# Altium project GPS_Tracker.PrjPcb (part 2 of 2)

## Sheet GSM_EC200U.SchDoc
size A3; SheetNumber: 3; SheetTotal: 3
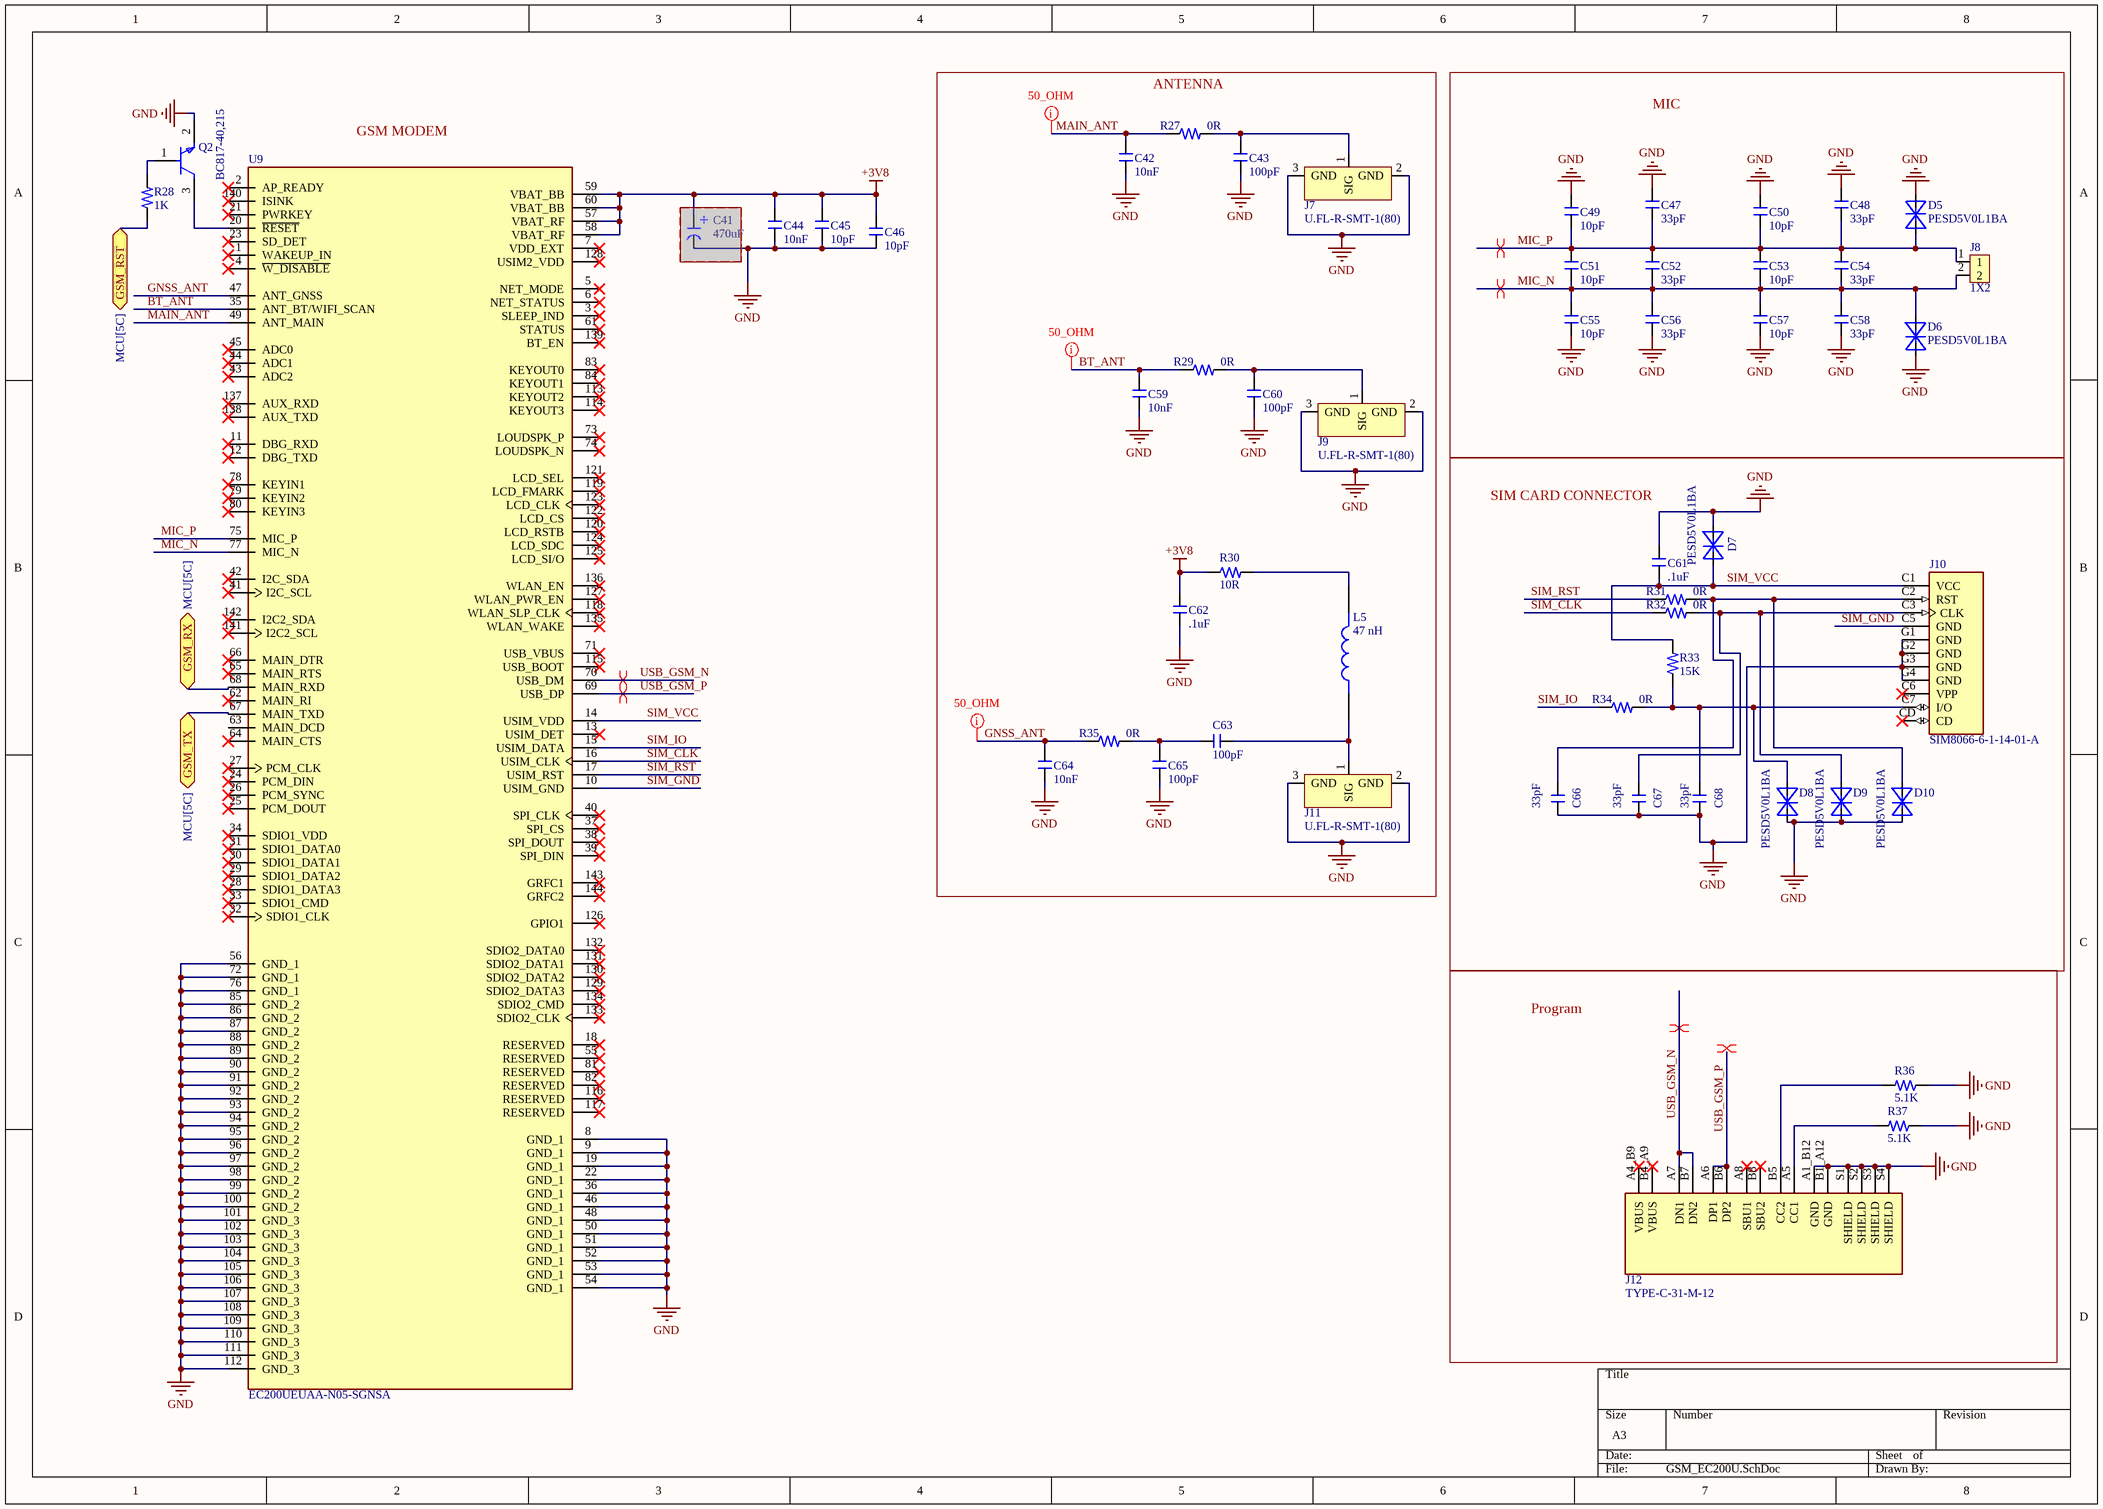
[diagram p2: GSM_EC200U.SchDoc]

### Parts
C41  470uF  [CAP SMD,D8xL10.2mm]  (masked out: inside a compile mask, not in the netlist)
C42  10nF  [Capacitor_0805]
C43  100pF  [Capacitor_0805]
C44  10nF  [Capacitor_0805]
C45  10pF  [Capacitor_0805]
C46  10pF  [Capacitor_0805]
C47  33pF  [Capacitor_0805]
C48  33pF  [Capacitor_0805]
C49  10pF  [Capacitor_0805]
C50  10pF  [Capacitor_0805]
C51  10pF  [Capacitor_0805]
C52  33pF  [Capacitor_0805]
C53  10pF  [Capacitor_0805]
C54  33pF  [Capacitor_0805]
C55  10pF  [Capacitor_0805]
C56  33pF  [Capacitor_0805]
C57  10pF  [Capacitor_0805]
C58  33pF  [Capacitor_0805]
C59  10nF  [Capacitor_0805]
C60  100pF  [Capacitor_0805]
C61  .1uF  [FB_0805]
C62  .1uF  [FB_0805]
C63  100pF  [Capacitor_0805]
C64  10nF  [Capacitor_0805]
C65  100pF  [Capacitor_0805]
C66  33pF  [Capacitor_0805]
C67  33pF  [Capacitor_0805]
C68  33pF  [Capacitor_0805]
D5  PESD5V0L1BA  [SOT323]
D6  PESD5V0L1BA  [SOT323]
D7  PESD5V0L1BA  [SOT323]
D8  PESD5V0L1BA  [SOT323]
D9  PESD5V0L1BA  [SOT323]
D10  PESD5V0L1BA  [SOT323]
J7  U.FL-R-SMT-1(80)  [UFL]
J8  1X2  [Header 1x2 2.54mm]
J9  U.FL-R-SMT-1(80)  [UFL]
J10  SIM8066-6-1-14-01-A  [SIM]
J11  U.FL-R-SMT-1(80)  [UFL]
J12  TYPE-C-31-M-12  [TYPE-C-31-M-12]
L5  47 nH  [Resistor_0603]
Q2  BC817-40,215  [FP-SOT23-MFG]
R27  0R  [Resistor_0805]
R28  1K  [Resistor_0805]
R29  0R  [Resistor_0805]
R30  10R  [Resistor_0603]
R31  0R  [Resistor_0805]
R32  0R  [Resistor_0805]
R33  15K  [Resistor_0805]
R34  0R  [Resistor_0805]
R35  0R  [Resistor_0805]
R36  5.1K  [Resistor_0805]
R37  5.1K  [Resistor_0805]
U9  EC200UEUAA-N05-SGNSA  [EC200UEUAA-N05-SGNSA]

### Blocks framed on the sheet
ANTENNA: C42 C43 C59 C60 C62-C65 J7 J9 J11 L5 R27 R29 R30 R35
MIC: C47-C58 D5 D6 J8
SIM CARD CONNECTOR: C61 C66-C68 D7-D10 J10 R31-R34
Program: J12 R36 R37

### Ports
GSM_RST (bidir, see MCU[5C]), GSM_RX (bidir, see MCU[5C]), GSM_TX (bidir, see MCU[5C])

### Nets
+3V8: C44.2 C45.2 C46.2 C62.2 R30.1 U9.57(VBAT_RF) U9.58(VBAT_RF) U9.59(VBAT_BB) U9.60(VBAT_BB)
GND: C42.1 C43.2 C44.1 C45.1 C46.1 C47.2 C48.2 C49.2 C50.2 C55.1 C56.1 C57.1 C58.1 C59.1 C60.2 C61.2 C62.1 C64.1 C65.2 C66.1 C67.1 C68.1 D5.C D6.C D7.A D8.C D9.C D10.C J7.2(GND) J7.3(GND) J9.2(GND) J9.3(GND) J10.G1(GND) J10.G2(GND) J10.G3(GND) J10.G4(GND) J11.2(GND) J11.3(GND) J12.A1_B12(GND) J12.B1_A12(GND) J12.S1(SHIELD) J12.S2(SHIELD) J12.S3(SHIELD) J12.S4(SHIELD) Q2.2(E) R36.1 R37.1 U9.8(GND_1) U9.9(GND_1) U9.19(GND_1) U9.22(GND_1) U9.36(GND_1) U9.46(GND_1) U9.48(GND_1) U9.50(GND_1) U9.51(GND_1) U9.52(GND_1) U9.53(GND_1) U9.54(GND_1) U9.56(GND_1) U9.72(GND_1) U9.76(GND_1) U9.85(GND_2) U9.86(GND_2) U9.87(GND_2) U9.88(GND_2) U9.89(GND_2) U9.90(GND_2) U9.91(GND_2) U9.92(GND_2) U9.93(GND_2) U9.94(GND_2) U9.95(GND_2) U9.96(GND_2) U9.97(GND_2) U9.98(GND_2) U9.99(GND_2) U9.100(GND_2) U9.101(GND_3) U9.102(GND_3) U9.103(GND_3) U9.104(GND_3) U9.105(GND_3) U9.106(GND_3) U9.107(GND_3) U9.108(GND_3) U9.109(GND_3) U9.110(GND_3) U9.111(GND_3) U9.112(GND_3)
BT_ANT: C59.2 R29.1 U9.35(ANT_BT/WIFI_SCAN)
GNSS_ANT: C64.2 R35.1 U9.47(ANT_GNSS)
MAIN_ANT: C42.2 R27.1 U9.49(ANT_MAIN)
MIC_N: C51.1 C52.1 C53.1 C54.1 C55.2 C56.2 C57.2 C58.2 D6.A J8.2 U9.77(MIC_N)
MIC_P: C47.1 C48.1 C49.1 C50.1 C51.2 C52.2 C53.2 C54.2 D5.A J8.1 U9.75(MIC_P)
SIM_CLK: R32.1 U9.16(USIM_CLK)
SIM_GND: J10.C5(GND) U9.10(USIM_GND)
SIM_IO: R34.1 U9.15(USIM_DATA)
SIM_RST: R31.1 U9.17(USIM_RST)
SIM_VCC: C61.1 D7.C J10.C1(VCC) R33.2 U9.14(USIM_VDD)
USB_GSM_N: J12.A7(DN1) J12.B7(DN2) U9.70(USB_DM)
USB_GSM_P: J12.A6(DP1) J12.B6(DP2) U9.69(USB_DP)
NetC43_1: C43.1 J7.1(SIG) R27.2
NetC60_1: C60.1 J9.1(SIG) R29.2
NetC63_1: C63.1 C65.1 R35.2
NetC63_2: C63.2 J11.1(SIG) L5.1
NetC66_2: C66.2 D10.A J10.C2(RST) R31.2
NetC67_2: C67.2 D9.A J10.C3(CLK) R32.2
NetC68_2: C68.2 D8.A J10.C7(I/O) R33.1 R34.2
NetJ12_A5: J12.A5(CC1) R37.2
NetJ12_B5: J12.B5(CC2) R36.2
NetL5_2: L5.2 R30.2
NetQ2_1: Q2.1(B) R28.2
NetQ2_3: Q2.3(C) U9.20(~{RESET})
NetR28_1: R28.1 ; port GSM_RST
NetU8_26: U9.68(MAIN_RXD) ; port GSM_RX
NetU8_27: U9.67(MAIN_TXD) ; port GSM_TX

Not connected (* = marked no-connect by the designer): J10 C6(VPP)* CD*; J12 A4_B9(VBUS)* A8(SBU1)* B4_A9(VBUS)* B8(SBU2)*; U9 1(WAKEUP_IN)* 2(AP_READY)* 3(SLEEP_IND)* 4(~{W_DISABLE})* 5(NET_MODE)* 6(NET_STATUS)* 7(VDD_EXT)* 11(DBG_RXD)* 12(DBG_TXD)* 13(USIM_DET)* 18(RESERVED)* 21(PWRKEY)* 23(SD_DET)* 24(PCM_DIN)* 25(PCM_DOUT)* 26(PCM_SYNC)* 27(PCM_CLK)* 28(SDIO1_DATA3)* 29(SDIO1_DATA2)* 30(SDIO1_DATA1)* 31(SDIO1_DATA0)* 32(SDIO1_CLK)* 33(SDIO1_CMD)* 34(SDIO1_VDD)* 37(SPI_CS)* 38(SPI_DOUT)* 39(SPI_DIN)* 40(SPI_CLK)* 41(I2C_SCL)* 42(I2C_SDA)* 43(ADC2)* 44(ADC1)* 45(ADC0)* 55(RESERVED)* 61(STATUS)* 62(MAIN_RI)* 63(MAIN_DCD) 64(MAIN_CTS)* 65(MAIN_RTS)* 66(MAIN_DTR)* 71(USB_VBUS)* 73(LOUDSPK_P)* 74(LOUDSPK_N)* 78(KEYIN1)* 79(KEYIN2)* 80(KEYIN3)* 81(RESERVED)* 82(RESERVED)* 83(KEYOUT0)* 84(KEYOUT1)* 113(KEYOUT2)* 114(KEYOUT3)* 115(USB_BOOT)* 116(RESERVED)* 117(RESERVED)* 118(WLAN_SLP_CLK)* 119(LCD_FMARK)* 120(LCD_RSTB)* 121(LCD_SEL)* 122(LCD_CS)* 123(LCD_CLK)* 124(LCD_SDC)* 125(LCD_SI/O)* 126(GPIO1)* 127(WLAN_PWR_EN)* 128(USIM2_VDD)* 129(SDIO2_DATA3)* 130(SDIO2_DATA2)* 131(SDIO2_DATA1)* 132(SDIO2_DATA0)* 133(SDIO2_CLK)* 134(SDIO2_CMD)* 135(WLAN_WAKE)* 136(WLAN_EN)* 137(AUX_RXD)* 138(AUX_TXD)* 139(BT_EN)* 140(ISINK)* 141(I2C2_SCL)* 142(I2C2_SDA)* 143(GRFC1)* 144(GRFC2)*

### Layout directives
differential pair: MIC_N, MIC_P
differential pair; net class 90_OHM: USB_GSM_N, USB_GSM_P
net class 50_OHM: BT_ANT, GNSS_ANT, MAIN_ANT

### Notes on the sheet
- (near U9) GSM MODEM
- (in symbol CAP 470uF) +

### Library data of the parts
C41 = CAP 470uF: Aluminum Electrolytic Capacitor, 470 uF, 16 V, ± 20%, 2000 hours @ 105°C, Radial Can - SMD; Manufacturer: Panasonic; Manufacturer Part Number: EEE-HBC471UAP; Voltage Rating: 16V; Ripple Current: 240mA; Leakage Current: 3uA; Dissipation Factor: 0.4%; Supplier: Mouser; Supplier Part Number: 667-EEE-HBC471UAP; RoHS: Yes; Category: Aluminum Electrolytic Capacitors; Stock: 104; Pricing: 1=1,02, 10=0,557, 50=0,557, 100=0,472, 1000=0,349, 10000=0,315 (USD); Mounting Technology: Surface Mount; Case/Package: Radial; Min Operating Temperature: -40°C; Max Operating Temperature: 105°C; Value: 470uF; Tolerance: 20%; Packaging: Tape and Reel; Package Quantity: 500; Voltage Rating (DC): 16V; Life (Hours): 2000Hour; Termination: SMD/SMT; Voltage: 16V; Series: HB; Construction: Cylindrical; Diameter: 8mm; Length: 10.2mm; Height: 10.2mm; Ratings: AEC-Q200; Radiation Hardening: No; RoHS Compliant: Yes; ComponentLink1URL: https://datasheet.ciiva.com/11780/0900766b80bed47d-11780359.pdf?src-supplier=Rs; ComponentLink1Description: https://datasheet.ciiva.com/11780/0900766b80bed47d-11780359.pdf?src-supplier=Rs; ComponentLink2URL: https://datasheet.ciiva.com/2985/aba0000ce117-2985891.pdf?src-supplier=Avnet; ComponentLink2Description: https://datasheet.ciiva.com/2985/aba0000ce117-2985891.pdf?src-supplier=Avnet; ComponentLink3URL: https://datasheet.ciiva.com/2985/aba0000ce117-2985890.pdf?src-supplier=Avnet; ComponentLink3Description: https://datasheet.ciiva.com/2985/aba0000ce117-2985890.pdf?src-supplier=Avnet; ComponentLink4URL: https://datasheet.ciiva.com/30093/aba0000ce117-30093671.pdf?src-supplier=Onlinecomponents.com; ComponentLink4Description: https://datasheet.ciiva.com/30093/aba0000ce117-30093671.pdf?src-supplier=Onlinecomponents.com
C42 C44 C59 C64 = Cap_10nF 0805: Multilayer Ceramic Capacitor, 0.01 uF, 50 V, ï¿½ 10%, X7R, 0805 [2012 Metric]; Manufacturer: Samsung; Manufacturer Part Number: CL21B103KBANNNC; Voltage: 50V; Supplier: Digikey; Supplier Part Number: 1276-1015-1-ND; RoHS: Yes; Category: Ceramic Capacitors; Stock: 2729; Pricing: 1=0,08, 10=0,011, 100=0,0096, 1000=0,0072 (USD); Mounting Technology: Surface Mount; Case/Package: 0805; Pins: 2; Case Code (Metric): 2012; Case Code (Imperial): 0805; Material: Ceramic; Min Operating Temperature: -55°C; Max Operating Temperature: 125°C; Value: 10nF; Tolerance: 10%; Dielectric: X7R; Voltage Rating (DC): 50V; Packaging: Tape and Reel; Voltage Rating: 50V; Series: CL; Construction: Flat; Length: 2mm; Height: 0.65mm; Depth: 1.25mm; Radiation Hardening: No; Lead Free: Lead Free; RoHS Compliant: Yes; ComponentLink1URL: https://datasheet.ciiva.com/25709/cl21b103kbannnc-25709781.pdf?src-supplier=Digikey; ComponentLink1Description: https://datasheet.ciiva.com/25709/cl21b103kbannnc-25709781.pdf?src-supplier=Digikey; ComponentLink2URL: https://datasheet.ciiva.com/29199/455082-da-01-en-vs-kondensator-0805-29199459.pdf?src-supplier=Conrad; ComponentLink2Description: https://datasheet.ciiva.com/29199/455082-da-01-en-vs-kondensator-0805-29199459.pdf?src-supplier=Conrad
C43 C60 C63 C65 = CAP 100pF 0805: 0805 100 pF 50 V ±5 % Tolerance NP0 SMT Multilayer Ceramic Capacitor; Manufacturer: Yageo; Manufacturer Part Number: CC0805JRNPO9BN101; Material: 4241ConductorMaterial; Tolerance: 5%; Dielectric: C0G; Voltage Rating: 50V; Temperature Coefficient: 30ppm/°C; Insulation Resistance: 100GR; Supplier: Arrow Electronics; Supplier Part Number: CC0805JRNPO9BN101; RoHS: Yes; Category: Ceramic Capacitors; Stock: 6144000; Pricing: 4000=0,0128, 8000=0,0088, 12000=0,0087, 28000=0,0086, 40000=0,0073, 100000=0,0072, 200000=0,005 (USD); Mounting Technology: Surface Mount; Case/Package: 0805; Pins: 2; Case Code (Imperial): 0805; Case Code (Metric): 2012; Dielectric Material: Ceramic; Min Operating Temperature: -55°C; Max Operating Temperature: 125°C; Value: 100pF; Packaging: Tape and Reel; Package Quantity: 4000; Voltage Rating (DC): 50V; Termination: SMD/SMT; Series: CC; Voltage Rating (AC): 50V; Length: 2mm; Width: 1.25mm; Height: 0.6mm; Depth: 1.25mm; Radiation Hardening: No; RoHS Compliant: Yes; Reach SVHC Compliant: No; Lead Free: Lead Free; Halogen Free: 5694HalogenFree; ComponentLink1URL: https://datasheet.ciiva.com/5425/upy-gp-np0-16v-to-50v-8-217813-5425504.pdf?src-supplier=Mouser; ComponentLink1Description: https://datasheet.ciiva.com/5425/upy-gp-np0-16v-to-50v-8-217813-5425504.pdf?src-supplier=Mouser; ComponentLink2URL: https://datasheet.ciiva.com/144/mlccorderingcode-144855.pdf?src-supplier=Digikey; ComponentLink2Description: https://datasheet.ciiva.com/144/mlccorderingcode-144855.pdf?src-supplier=Digikey; ComponentLink3URL: https://datasheet.ciiva.com/144/mlccorderingcode-144854.pdf?src-supplier=Digikey; ComponentLink3Description: https://datasheet.ciiva.com/144/mlccorderingcode-144854.pdf?src-supplier=Digikey; ComponentLink4URL: https://datasheet.ciiva.com/144/mlccorderingcode-144856.pdf?src-supplier=Digikey; ComponentLink4Description: https://datasheet.ciiva.com/144/mlccorderingcode-144856.pdf?src-supplier=Digikey; ComponentLink5URL: https://datasheet.ciiva.com/8033/1443161-8033950.pdf?src-supplier=Element14; ComponentLink5Description: https://datasheet.ciiva.com/8033/1443161-8033950.pdf?src-supplier=Element14; ComponentLink6URL: https://datasheet.ciiva.com/11464/upy-gp-np0-16v-to-50v-8-11464745.pdf?src-supplier=Avnet; ComponentLink6Description: https://datasheet.ciiva.com/11464/upy-gp-np0-16v-to-50v-8-11464745.pdf?src-supplier=Avnet; ComponentLink7URL: https://datasheet.ciiva.com/8033/1443161-8033947.pdf?src-supplier=Element14; ComponentLink7Description: https://datasheet.ciiva.com/8033/1443161-8033947.pdf?src-supplier=Element14; ComponentLink8URL: https://datasheet.ciiva.com/26829/getdatasheetpartid-92514-26829509.pdf?src-supplier=Verical; ComponentLink8Description: https://datasheet.ciiva.com/26829/getdatasheetpartid-92514-26829509.pdf?src-supplier=Verical
C45 C46 C49-C51 C53 C55 C57 = CAP 10pF 0805: Multilayer Ceramic Capacitor, 10 pF, 50 V, ï¿½ 5%, C0G (NP0), 0805 [2012 Metric]; Manufacturer: Yageo; Manufacturer Part Number: CC0805JRNPO9BN100; Temperature Coefficient: 30ppm/°C; Supplier: Digikey; Supplier Part Number: 311-1099-1-ND; RoHS: Yes; Category: Ceramic Capacitors; Stock: 29904; Pricing: 1=0,1, 10=0,048, 100=0,0284, 1000=0,01828 (USD); Pins: 2NUMBER; Halogen Free: 5694HalogenFree; Lead Free: 5697LeadFree; ComponentLink1URL: https://datasheet.ciiva.com/144/mlccorderingcode-144670.pdf?src-supplier=Digikey; ComponentLink1Description: https://datasheet.ciiva.com/144/mlccorderingcode-144670.pdf?src-supplier=Digikey; ComponentLink2URL: https://datasheet.ciiva.com/144/mlccorderingcode-144671.pdf?src-supplier=Digikey; ComponentLink2Description: https://datasheet.ciiva.com/144/mlccorderingcode-144671.pdf?src-supplier=Digikey; ComponentLink3URL: https://datasheet.ciiva.com/144/mlccorderingcode-144672.pdf?src-supplier=Digikey; ComponentLink3Description: https://datasheet.ciiva.com/144/mlccorderingcode-144672.pdf?src-supplier=Digikey; ComponentLink4URL: https://datasheet.ciiva.com/11464/upy-gp-np0-16v-to-50v-8-11464744.pdf?src-supplier=Avnet; ComponentLink4Description: https://datasheet.ciiva.com/11464/upy-gp-np0-16v-to-50v-8-11464744.pdf?src-supplier=Avnet
C47 C48 C52 C54 C56 C58 C66-C68 = CAP 33pF: Multilayer Ceramic Capacitor, 33 pF, 50 V, ï¿½ 5, C0G (NP0), 0805 [2012 Metric]; Manufacturer: Yageo; Manufacturer Part Number: CC0805JRNPO9BN330; Dielectric Material: 4241ConductorMaterial; Temperature Coefficient: 30ppm/°C; Voltage Rating (AC): 50V; Supplier: Arrow Electronics; Supplier Part Number: CC0805JRNPO9BN330; RoHS: Yes; Category: Ceramic Capacitors; Stock: 532000; Pricing: 4000=0,0099, 8000=0,0078, 12000=0,0077, 20000=0,005 (USD); Halogen Free: 5694HalogenFree; Lead Free: 5697LeadFree; ComponentLink1URL: https://datasheet.ciiva.com/8033/1443161-8033942.pdf?src-supplier=Element14; ComponentLink1Description: https://datasheet.ciiva.com/8033/1443161-8033942.pdf?src-supplier=Element14; ComponentLink2URL: https://datasheet.ciiva.com/8033/1443161-8033944.pdf?src-supplier=Element14; ComponentLink2Description: https://datasheet.ciiva.com/8033/1443161-8033944.pdf?src-supplier=Element14; ComponentLink3URL: https://datasheet.ciiva.com/144/mlccorderingcode-144778.pdf?src-supplier=Digikey; ComponentLink3Description: https://datasheet.ciiva.com/144/mlccorderingcode-144778.pdf?src-supplier=Digikey; ComponentLink4URL: https://datasheet.ciiva.com/144/mlccorderingcode-144779.pdf?src-supplier=Digikey; ComponentLink4Description: https://datasheet.ciiva.com/144/mlccorderingcode-144779.pdf?src-supplier=Digikey; ComponentLink5URL: https://datasheet.ciiva.com/144/mlccorderingcode-144780.pdf?src-supplier=Digikey; ComponentLink5Description: https://datasheet.ciiva.com/144/mlccorderingcode-144780.pdf?src-supplier=Digikey; ComponentLink6URL: https://datasheet.ciiva.com/11464/upy-gp-np0-16v-to-50v-8-11464747.pdf?src-supplier=Avnet; ComponentLink6Description: https://datasheet.ciiva.com/11464/upy-gp-np0-16v-to-50v-8-11464747.pdf?src-supplier=Avnet; ComponentLink7URL: https://datasheet.ciiva.com/29241/445349-da-01-en-kerko-chip-0805-np0-33pf-5proz-50v-g-29241975.pdf?src-supplier=Conrad; ComponentLink7Description: https://datasheet.ciiva.com/29241/445349-da-01-en-kerko-chip-0805-np0-33pf-5proz-50v-g-29241975.pdf?src-supplier=Conrad
C61 C62 = CAP .1 UF: Cap Ceramic 0.1uF 100V X7R 10% Pad SMD 0805 Fail Safe with Soft Termination 125C Automotive T/R; Manufacturer: Murata; Manufacturer Part Number: GCE21BR72A104KA01L; Material: 4241ConductorMaterial; Value: 100nF; Supplier: Mouser; Supplier Part Number: 81-GCE21BR72A104KA1L; RoHS: Yes; Category: Ceramic Capacitors; Stock: 45477; Pricing: 1=0,25, 10=0,152, 50=0,152, 100=0,1, 1000=0,073, 10000=0,055 (USD); Mounting Technology: Surface Mount; Case/Package: 0805; Case Code (Imperial): 0805; Case Code (Metric): 2012; Min Operating Temperature: -55°C; Max Operating Temperature: 125°C; Features: Soft Termination; Packaging: Cut Tape; Tolerance: 10%; Voltage Rating: 100V; Series: GCE; Length: 2mm; Width: 1.25mm; Height: 1.45mm; Thickness: 1.25mm; Ratings: AEC-Q200; Lead Free: Lead Free; RoHS Compliant: Yes; ComponentLink1URL: http://search.murata.co.jp/Ceramy/image/img/A01X/partnumbering_e_02.pdf?src-supplier=Digikey; ComponentLink1Description: http://search.murata.co.jp/Ceramy/image/img/A01X/partnumbering_e_02.pdf?src-supplier=Digikey; ComponentLink2URL: http://search.murata.co.jp/Ceramy/image/img/A01X/G101/ENG/GCE21BR72A104KA01-01.pdf?src-supplier=Digikey; ComponentLink2Description: http://search.murata.co.jp/Ceramy/image/img/A01X/G101/ENG/GCE21BR72A104KA01-01.pdf?src-supplier=Digikey
D5-D10 = ESD PESD5V0L1BA: Esd Protection Device, Tvs, 7.6 V, Sod-323, 2 Rohs Compliant: Yes; Manufacturer: NXP Semiconductors; Breakdown Voltage: 7V; Number of Channels: 1NUMBER; Operating Supply Voltage: 5V; Supplier: Rs; Supplier Part Number: 0509447; Manufacturer Part Number: PESD5V0L1BA; RoHS: Yes; Category: TVS Diodes; Pricing: 20=0,211, 200=0,195, 500=0,183, 1000=0,167, 2000=0,154 (EUR); ComponentLink1URL: https://datasheet.ciiva.com/7973/682594-7973878.pdf?src-supplier=Element14; ComponentLink1Description: https://datasheet.ciiva.com/7973/682594-7973878.pdf?src-supplier=Element14
J7 J9 J11 = U.FL-R-SMT-1(80): RF COAX Connector, U.FL JACK, PCB, 50 OHM; Co; Connector Type: U.FL Coaxial; Body Style: Straight; Manufacturer: Hirose; Frequency: 8GHz; Number of Contacts: 1NUMBER; Supplier: Avnet; Supplier Part Number: U.FL-R-SMT-1(80); Manufacturer Part Number: U.FL-R-SMT-1(80); RoHS: Yes; Category: RF / Coaxial Connectors; Stock: 10; Pricing: 10000=0,62403 (USD); Contact Plating: 157,159ConductorMaterial; Orientation: 5491OrientationType; Height: 1.45mm; Lead Free: 5697LeadFree; ComponentLink1URL: http://www.mouser.com/ds/2/185/U.FL_catalog-939761.pdf?src-supplier=Mouser; ComponentLink1Description: http://www.mouser.com/ds/2/185/U.FL_catalog-939761.pdf?src-supplier=Mouser; ComponentLink2URL: https://www.hirose.com/product/en/download_file/key_name/U.FL-R-SMT-1%2880%29/category/Specification%20Sheet/doc_file_id/37638/?file_category_id=9&item_id=03310472280&is_series=&src-supplier=Digikey; ComponentLink2Description: https://www.hirose.com/product/en/download_file/key_name/U.FL-R-SMT-1%2880%29/category/Specification%20Sheet/doc_file_id/37638/?file_category_id=9&item_id=03310472280&is_series=&src-supplier=Digikey; ComponentLink3URL: https://datasheet.octopart.com/U.FL-R-SMT-1%2880%29-Hirose-datasheet-137256329.pdf?src-supplier=Future+Electronics; ComponentLink3Description: https://datasheet.octopart.com/U.FL-R-SMT-1%2880%29-Hirose-datasheet-137256329.pdf?src-supplier=Future+Electronics; ComponentLink4URL: https://datasheet.octopart.com/U.FL-R-SMT-1%2880%29-Hirose-datasheet-151510633.pdf?src-supplier=TME; ComponentLink4Description: https://datasheet.octopart.com/U.FL-R-SMT-1%2880%29-Hirose-datasheet-151510633.pdf?src-supplier=TME
J8 = Header 1X2 2.54 mm: Conn Unshrouded Header HDR 2 POS 2.54mm Solder ST Thru-Hole Automotive Carton; Manufacturer: TE Connectivity; Manufacturer Part Number: 826629-2; Contact Style: 4753ConnectorType; Insulation Resistance: 5GR; Number of Contacts: 2NUMBER; Gender: 29Gender; Current Rating: 5A; Supplier: Avnet; Supplier Part Number: 826629-2; RoHS: Yes; Category: Headers and Wire Housings; Stock: 21749; Pricing: 1=0,15044, 10=0,14915, 30=0,14703, 50=0,14491, 100=0,14279 (USD); Pins: 2NUMBER; Contact Plating: 154,157ConductorMaterial; Color: 49Colour; Housing Color: 49Colour; Housing Material: 175ConductorMaterial; Orientation: 5495OrientationType; Height: 10mm; Lead Pitch: 2.54mm; Row Spacing: 2.54mm; RoHS Compliant: 5897YesNo; Lead Free: 5697LeadFree; ComponentLink1URL: https://www.te.com/commerce/DocumentDelivery/DDEController?Action=srchrtrv&amp;DocNm=826629&amp;DocType=Customer+Drawing&amp;DocLang=English&src-supplier=Digikey; ComponentLink1Description: https://www.te.com/commerce/DocumentDelivery/DDEController?Action=srchrtrv&amp;DocNm=826629&amp;DocType=Customer+Drawing&amp;DocLang=English&src-supplier=Digikey; ComponentLink2URL: https://datasheet.octopart.com/826629-2-TE-Connectivity---AMP-datasheet-17024315.pdf?src-supplier=Element14; ComponentLink2Description: https://datasheet.octopart.com/826629-2-TE-Connectivity---AMP-datasheet-17024315.pdf?src-supplier=Element14; ComponentLink3URL: https://datasheet.octopart.com/826629-2-TE-Connectivity---AMP-datasheet-179310416.pdf?src-supplier=Farnell; ComponentLink3Description: https://datasheet.octopart.com/826629-2-TE-Connectivity---AMP-datasheet-179310416.pdf?src-supplier=Farnell; ComponentLink4URL: https://datasheet.octopart.com/826629-2-TE-Connectivity---AMP-datasheet-44414285.pdf?src-supplier=Electro+Sonic; ComponentLink4Description: https://datasheet.octopart.com/826629-2-TE-Connectivity---AMP-datasheet-44414285.pdf?src-supplier=Electro+Sonic; ComponentLink5URL: https://datasheet.octopart.com/826629-2-TE-Connectivity-datasheet-181566106.pdf?src-supplier=Sager+Electronics; ComponentLink5Description: https://datasheet.octopart.com/826629-2-TE-Connectivity-datasheet-181566106.pdf?src-supplier=Sager+Electronics
J10 = SIM8066-6-1-14-01-A: SIM8066 Series 6 Position 1.44 mm Pitch Push Push Type Nano SIM Card Connector; Manufacturer: Global Connector Technology; Supplier: Farnell; Supplier Part Number: 3772945; Manufacturer Part Number: SIM8066-6-1-14-01-A; RoHS: No; Category: Connectors; Stock: 12609; Pricing: 1=1,11, 37=0,904, 112=0,859, 300=0,813, 750=0,677 (EUR); Pins: 6; ComponentLink1URL: https://datasheet.octopart.com/SIM8066-6-1-14-01-A-Global-Connector-Technology-datasheet-155811920.pdf?src-supplier=Future+Electronics; ComponentLink1Description: https://datasheet.octopart.com/SIM8066-6-1-14-01-A-Global-Connector-Technology-datasheet-155811920.pdf?src-supplier=Future+Electronics
J12 = TYPE-C-31-M-12: Manufacturer: HRO Electronics; Supplier: LCSC; Supplier Part Number: C165948; Manufacturer Part Number: TYPE-C-31-M-12; RoHS: No; Category: LDO; Stock: 137245; Pricing: 5=0,171, 50=0,1346, 150=0,1168, 1000=0,0966, 2000=0,0923, 5000=0,0896 (USD)
L5 = Inductor 47 nH 0603: Ind RF Chip Shielded Multi-Layer 47nH 20% 50MHz 10Q-Factor Ferrite 200mA 0603 Punched Paper T/R; Manufacturer: TDK EPCOS; Manufacturer Part Number: MLF1608D47NMTA00; Supplier: Mouser; Supplier Part Number: 810-MLF1608D47NMTA00; RoHS: Yes; Category: Fixed Inductors; Stock: 24480; Pricing: 1=0,1, 10=0,084, 50=0,084, 100=0,069, 1000=0,057, 10000=0,044 (USD); ComponentLink1URL: https://datasheet.ciiva.com/29698/inductor-commercial-standard-mlf-en-29698906.pdf?src-supplier=Digikey; ComponentLink1Description: https://datasheet.ciiva.com/29698/inductor-commercial-standard-mlf-en-29698906.pdf?src-supplier=Digikey; ComponentLink2URL: https://datasheet.ciiva.com/29698/inductor-commercial-standard-mlf-en-29698907.pdf?src-supplier=Digikey; ComponentLink2Description: https://datasheet.ciiva.com/29698/inductor-commercial-standard-mlf-en-29698907.pdf?src-supplier=Digikey; ComponentLink3URL: https://datasheet.ciiva.com/29698/inductor-commercial-standard-mlf-en-29698908.pdf?src-supplier=Digikey; ComponentLink3Description: https://datasheet.ciiva.com/29698/inductor-commercial-standard-mlf-en-29698908.pdf?src-supplier=Digikey
Q2 = CMP-14406-000007-1: TRANS NPN 45V 0.5A SOT23; Manufacturer: Nexperia; Collector Emitter Saturation Voltage: 700mV; Power Dissipation: 250mW; Collector Base Voltage: 50V; Unity Gain Freq: 100MHz; Hfe Max: 600; Rthja Max: 500K/W; Emitter Base Voltage: 5V; Max Collector Current: 500mA; Hfe Testvce: 1V; Automotive Grade: Grade 0; Hfe Min: 250; Max Junction Temp: +150°C; Number Of Npn: 1; Hfe Testic: 100mA; Octopart: https://octopart.com/bc817-40%2C215-nexperia-78739081; Lead Free: Yes; Ipc Land Pattern Name: SOT95P230X100-3; Manufacturer Part Number: BC817-40,215; RoHS: TRUE; Collector Emitter Breakdown Voltage: 45V; Digikey Description: TRANS NPN 45V 0.5A SOT23; ComponentLink2URL: https://assets.nexperia.com/documents/data-sheet/BC817_SER.pdf; Temperature Range High: +150°C; Mouser Description: BC817 Series 45 V 500 mA 250 mW SMT NPN General-Purpose Transistor - SOT-23-; Device Class L3: BJTs; Temperature: to +150°C; Height: 1.1mm; Automotive: Yes; Ambient Temperature Range Low: -65°C; Package: SOT23; Collector Emitter Voltage: 45V; Category: Trans; ComponentLink2Description: Datasheet; Device Class L2: Transistors; Ambient Temperature Range High: +150°C; Number Of Elements: 1; Device Class L1: Discrete Semiconductors; Footprint Url: https://assets.nexperia.com/documents/outline-drawing/SOT23.pdf
R27 R29 R31 R32 R34 R35 = Res 0 R 0805: GENERAL PURPOSE CHIP RESISTOR Metal Glaze/thick Film, 0.125W, 0ohm, Surface Mount, 0805; Manufacturer: Yageo; Manufacturer Part Number: RC0805JR-070RL; Value: 0mR; Tolerance: 5%; Voltage Rating: 150V; Power Rating: 125mW; Temperature Coefficient: 200ppm/°C; Supplier: Digikey; Supplier Part Number: 311-0.0ARCT-ND; RoHS: Yes; Category: Chip SMD Resistors; Stock: 947133; Pricing: 1=0,1, 10=0,015, 25=0,0128, 50=0,011, 100=0,0097, 250=0,00812, 500=0,00716, 1000=0,00633 (USD); Case/Package: 0805; Pins: 2; Case Code (Imperial): 0805; Case Code (Metric): 2012; Contact Plating: Tin,Matte; Min Operating Temperature: -55°C; Max Operating Temperature: 155°C; Packaging: Tape and Reel; Series: RC; Voltage Rating (DC): 150V; Termination: SMD/SMT; Resistor Type: Thick Film; Features: Moisture Resistant; Max Power Dissipation: 125mW; Number of Terminations: 2; Construction: Rectangular; Technology: THICK FILM; Resistance Tolerance: 5%; Length: 2mm; Width: 1.25mm; Height: 0.5mm; Depth: 1.25mm; RoHS Compliant: Yes; Military Standard: Not; Reach SVHC Compliant: Unknown; Lead Free: 5697LeadFree; ComponentLink1URL: https://datasheet.ciiva.com/11819/0900766b8106beab-11819430.pdf?src-supplier=Rs; ComponentLink1Description: https://datasheet.ciiva.com/11819/0900766b8106beab-11819430.pdf?src-supplier=Rs; ComponentLink2URL: https://datasheet.ciiva.com/7941/1738694-7941861.pdf?src-supplier=Element14; ComponentLink2Description: https://datasheet.ciiva.com/7941/1738694-7941861.pdf?src-supplier=Element14; ComponentLink3URL: https://datasheet.ciiva.com/7941/1738694-7941862.pdf?src-supplier=Element14; ComponentLink3Description: https://datasheet.ciiva.com/7941/1738694-7941862.pdf?src-supplier=Element14; ComponentLink4URL: https://datasheet.ciiva.com/7941/1738694-7941863.pdf?src-supplier=Element14; ComponentLink4Description: https://datasheet.ciiva.com/7941/1738694-7941863.pdf?src-supplier=Element14
R28 = Res 1K 0805: 125Mw Thick Film Resistors 100Ppm/ 1% 1K 0805 Chip Resistor Surface Mount Rohs; Manufacturer: Yageo; Manufacturer Part Number: RC0805FR-071KL; Value: 1kR; Voltage Rating (DC): 150V; Temperature Coefficient: 100ppm/°C; Supplier: Avnet; Supplier Part Number: 82K7536; RoHS: Yes; Category: Chip SMD Resistors; Stock: 255910; Pricing: 10=0,014, 25=0,012, 50=0,01, 100=0,009 (USD); Case/Package: 0805; Pins: 2; Case Code (Metric): 2012; Case Code (Imperial): 0805; Min Operating Temperature: -55°C; Max Operating Temperature: 155°C; Tolerance: 1%; Packaging: Tape and Reel; Resistor Type: Thick Film; Package Quantity: 1; Voltage Rating: 150V; Termination: SMD/SMT; Series: RC; Power Rating: 125mW; Number of Terminations: 2; Max Power Dissipation: 125mW; Features: Moisture Resistant; Resistance Tolerance: 1%; Construction: Rectangular; Voltage Rating (AC): 150V; Length: 0.079inch; Width: 0.049inch; Height: 0.024inch; Depth: 1.25mm; Reach SVHC Compliant: No; Lead Free: Lead Free; RoHS Compliant: Yes; Military Standard: Not; ComponentLink1URL: https://datasheet.ciiva.com/7941/1686128-7941719.pdf?src-supplier=Element14; ComponentLink1Description: https://datasheet.ciiva.com/7941/1686128-7941719.pdf?src-supplier=Element14; ComponentLink2URL: https://datasheet.ciiva.com/46385/444164-46385020.pdf?src-supplier=Element14; ComponentLink2Description: https://datasheet.ciiva.com/46385/444164-46385020.pdf?src-supplier=Element14; ComponentLink3URL: https://datasheet.ciiva.com/2456/pyu-r-int-thick-7-2456976.pdf?src-supplier=Digikey; ComponentLink3Description: https://datasheet.ciiva.com/2456/pyu-r-int-thick-7-2456976.pdf?src-supplier=Digikey; ComponentLink4URL: https://datasheet.ciiva.com/2456/pyu-r-int-thick-7-2456977.pdf?src-supplier=Digikey; ComponentLink4Description: https://datasheet.ciiva.com/2456/pyu-r-int-thick-7-2456977.pdf?src-supplier=Digikey; ComponentLink5URL: https://datasheet.ciiva.com/2456/pyu-r-int-thick-7-2456975.pdf?src-supplier=Digikey; ComponentLink5Description: https://datasheet.ciiva.com/2456/pyu-r-int-thick-7-2456975.pdf?src-supplier=Digikey; ComponentLink6URL: https://datasheet.ciiva.com/16850/rc0805-16850409.pdf?src-supplier=Future+Electronics; ComponentLink6Description: https://datasheet.ciiva.com/16850/rc0805-16850409.pdf?src-supplier=Future+Electronics
R30 = Res 10 OHM 0603: Res Thick Film 0603 10 Ohm 1% 0.1W(1/10W) ±200ppm/C Pad SMD T/R; Manufacturer: Yageo; Manufacturer Part Number: RC0603FR-0710RL; Temperature Coefficient: 200ppm/°C; Power Rating: 100mW; Voltage Rating: 50V; Supplier: Avnet; Supplier Part Number: RC0603FR-0710RL; RoHS: Yes; Category: Chip SMD Resistors; Stock: 1840000; Pricing: 5000=0,00309, 10000=0,00304, 20000=0,003, 30000=0,00295, 40000=0,0029 (USD); Case/Package: 0603; Pins: 2; Contact Plating: Tin,Matte; Case Code (Imperial): 0603; Case Code (Metric): 1608; Min Operating Temperature: -55°C; Max Operating Temperature: 155°C; Value: 10R; Tolerance: 1%; Resistor Type: Thick Film; Packaging: Tape and Reel; Voltage Rating (DC): 50V; Termination: SMD/SMT; Features: Moisture Resistant; Series: RC; Max Power Dissipation: 100mW; Number of Terminations: 2; Resistance Tolerance: 1%; Construction: Rectangular; Technology: THICK FILM; Length: 1.6mm; Width: 0.8mm; Height: 0.45mm; Depth: 0.8mm; Reach SVHC Compliant: No; Military Standard: Not; RoHS Compliant: Yes; Lead Free: 5697LeadFree; ComponentLink1URL: https://datasheet.ciiva.com/11808/0900766b80f96399-11808140.pdf?src-supplier=Rs; ComponentLink1Description: https://datasheet.ciiva.com/11808/0900766b80f96399-11808140.pdf?src-supplier=Rs; ComponentLink2URL: https://datasheet.ciiva.com/7746/443971-7746245.pdf?src-supplier=Element14; ComponentLink2Description: https://datasheet.ciiva.com/7746/443971-7746245.pdf?src-supplier=Element14; ComponentLink3URL: https://datasheet.ciiva.com/8891/pyu-rc0603-51-rohs-l-4-8891285.pdf?src-supplier=Avnet; ComponentLink3Description: https://datasheet.ciiva.com/8891/pyu-rc0603-51-rohs-l-4-8891285.pdf?src-supplier=Avnet
R33 = RES 15K 0805: 125Mw Thick Film Resistors 100Ppm/ 1% 15K 0805 Chip Resistor Surface Mount Rohs; Manufacturer: Yageo; Manufacturer Part Number: RC0805FR-0715KL; Value: 15kR; Voltage Rating: 150V; Temperature Coefficient: 100ppm/°C; Supplier: Avnet; Supplier Part Number: RC0805FR-0715KL; RoHS: Yes; Category: Chip SMD Resistors; Stock: 15000; Pricing: 5000=0,00212, 10000=0,00209, 20000=0,00206, 30000=0,00203, 40000=0,00199 (USD); Case/Package: 0805; Case Code (Metric): 2012; Case Code (Imperial): 0805; Weight: 0.000194oz; Min Operating Temperature: -55°C; Max Operating Temperature: 155°C; Packaging: Tape and Reel; Tolerance: 1%; Package Quantity: 1; Resistor Type: Thick Film; Termination: SMD/SMT; Series: RC; Power Rating: 125mW; Number of Terminations: 2; Max Power Dissipation: 125mW; Features: Moisture Resistant; Construction: Rectangular; Resistance Tolerance: 1%; Voltage Rating (AC): 150V; Length: 2mm; Width: 0.049inch; Height: 0.024inch; Depth: 1.25mm; Reach SVHC Compliant: No; RoHS Compliant: Yes; Lead Free: 5697LeadFree; Military Standard: Not; ComponentLink1URL: https://datasheet.ciiva.com/46412/444164-46412861.pdf?src-supplier=Element14; ComponentLink1Description: https://datasheet.ciiva.com/46412/444164-46412861.pdf?src-supplier=Element14; ComponentLink2URL: https://datasheet.ciiva.com/46447/444164-46447567.pdf?src-supplier=Element14; ComponentLink2Description: https://datasheet.ciiva.com/46447/444164-46447567.pdf?src-supplier=Element14; ComponentLink3URL: https://datasheet.ciiva.com/2457/pyu-r-int-thick-7-2457069.pdf?src-supplier=Digikey; ComponentLink3Description: https://datasheet.ciiva.com/2457/pyu-r-int-thick-7-2457069.pdf?src-supplier=Digikey; ComponentLink4URL: https://datasheet.ciiva.com/2457/pyu-r-int-thick-7-2457070.pdf?src-supplier=Digikey; ComponentLink4Description: https://datasheet.ciiva.com/2457/pyu-r-int-thick-7-2457070.pdf?src-supplier=Digikey; ComponentLink5URL: https://datasheet.ciiva.com/2457/pyu-r-int-thick-7-2457068.pdf?src-supplier=Digikey; ComponentLink5Description: https://datasheet.ciiva.com/2457/pyu-r-int-thick-7-2457068.pdf?src-supplier=Digikey; ComponentLink6URL: https://datasheet.ciiva.com/12577/rc0805-12577708.pdf?src-supplier=Mouser; ComponentLink6Description: https://datasheet.ciiva.com/12577/rc0805-12577708.pdf?src-supplier=Mouser
R36 R37 = RES 5.1K 0805: Res Thin Film 0805 5.1K Ohm 0.1% 1/8W ±10ppm/°C Molded SMD Paper T/R; Manufacturer: Yageo; Manufacturer Part Number: RT0805BRD075K1L; Value: 5.1kR; Power Rating: 125mW; Voltage Rating: 150V; Temperature Coefficient: 25ppm/°C; Supplier: Digikey; Supplier Part Number: YAG1938CT-ND; RoHS: Yes; Category: Chip SMD Resistors; Stock: 24867; Pricing: 1=0,14, 10=0,099, 50=0,0918, 100=0,0826, 500=0,06324, 1000=0,05712 (USD); Case/Package: 0805; Case Code (Metric): 2012; Case Code (Imperial): 0805; Weight: 0.000194oz; Min Operating Temperature: -55°C; Max Operating Temperature: 155°C; Package Quantity: 5000; Packaging: Tape and Reel; Number of Terminations: 2; Termination: SMD/SMT; Max Power Dissipation: 125mW; Voltage Rating (DC): 150V; Features: Moisture Resistant; Series: RT; Length: 0.079inch; Width: 1.25mm; Height: 0.024inch; Lead Free: Lead Free; RoHS Compliant: Yes; ComponentLink1URL: https://datasheet.ciiva.com/12810/pyu-rt-1-to-0-05-rohs-l-4-12810709.pdf?src-supplier=Mouser; ComponentLink1Description: https://datasheet.ciiva.com/12810/pyu-rt-1-to-0-05-rohs-l-4-12810709.pdf?src-supplier=Mouser; ComponentLink2URL: https://datasheet.ciiva.com/2585/pyu-rt-1-to-0-05-rohs-l-4-2585107.pdf?src-supplier=Digikey; ComponentLink2Description: https://datasheet.ciiva.com/2585/pyu-rt-1-to-0-05-rohs-l-4-2585107.pdf?src-supplier=Digikey; ComponentLink3URL: https://datasheet.ciiva.com/46635/pyu-rt-1-to-0-05-rohs-l-5-46635340.pdf?src-supplier=Digikey; ComponentLink3Description: https://datasheet.ciiva.com/46635/pyu-rt-1-to-0-05-rohs-l-5-46635340.pdf?src-supplier=Digikey
U9 = EC200UEUAA-N05-SGNSA: Manufacturer: Quectel Wireless Solutions; Supplier: Digikey; Supplier Part Number: 2958-EC200UEUAA-N05-SGNSATR-ND; Manufacturer Part Number: EC200UEUAA-N05-SGNSA; RoHS: No; Category: Uncategorized; Pricing: 250=17,84728, 500=17,1182 (USD)

## Nets that join several sheets
+3V3: Power_Supply (C12.1 C19.1 U6.2 U6.4), MCU (14 pins)
+3V8: Power_Supply (C11.2 C17.1 R7.2 U5.4), GSM_EC200U (9 pins)
GND: Power_Supply (25 pins), MCU (38 pins), GSM_EC200U (90 pins)
NetR5_2: Power_Supply (R5.2), MCU (U8.14)
NetR28_1: MCU (U8.19), GSM_EC200U (R28.1)
NetU8_26: MCU (U8.26), GSM_EC200U (U9.68)
NetU8_27: MCU (U8.27), GSM_EC200U (U9.67)